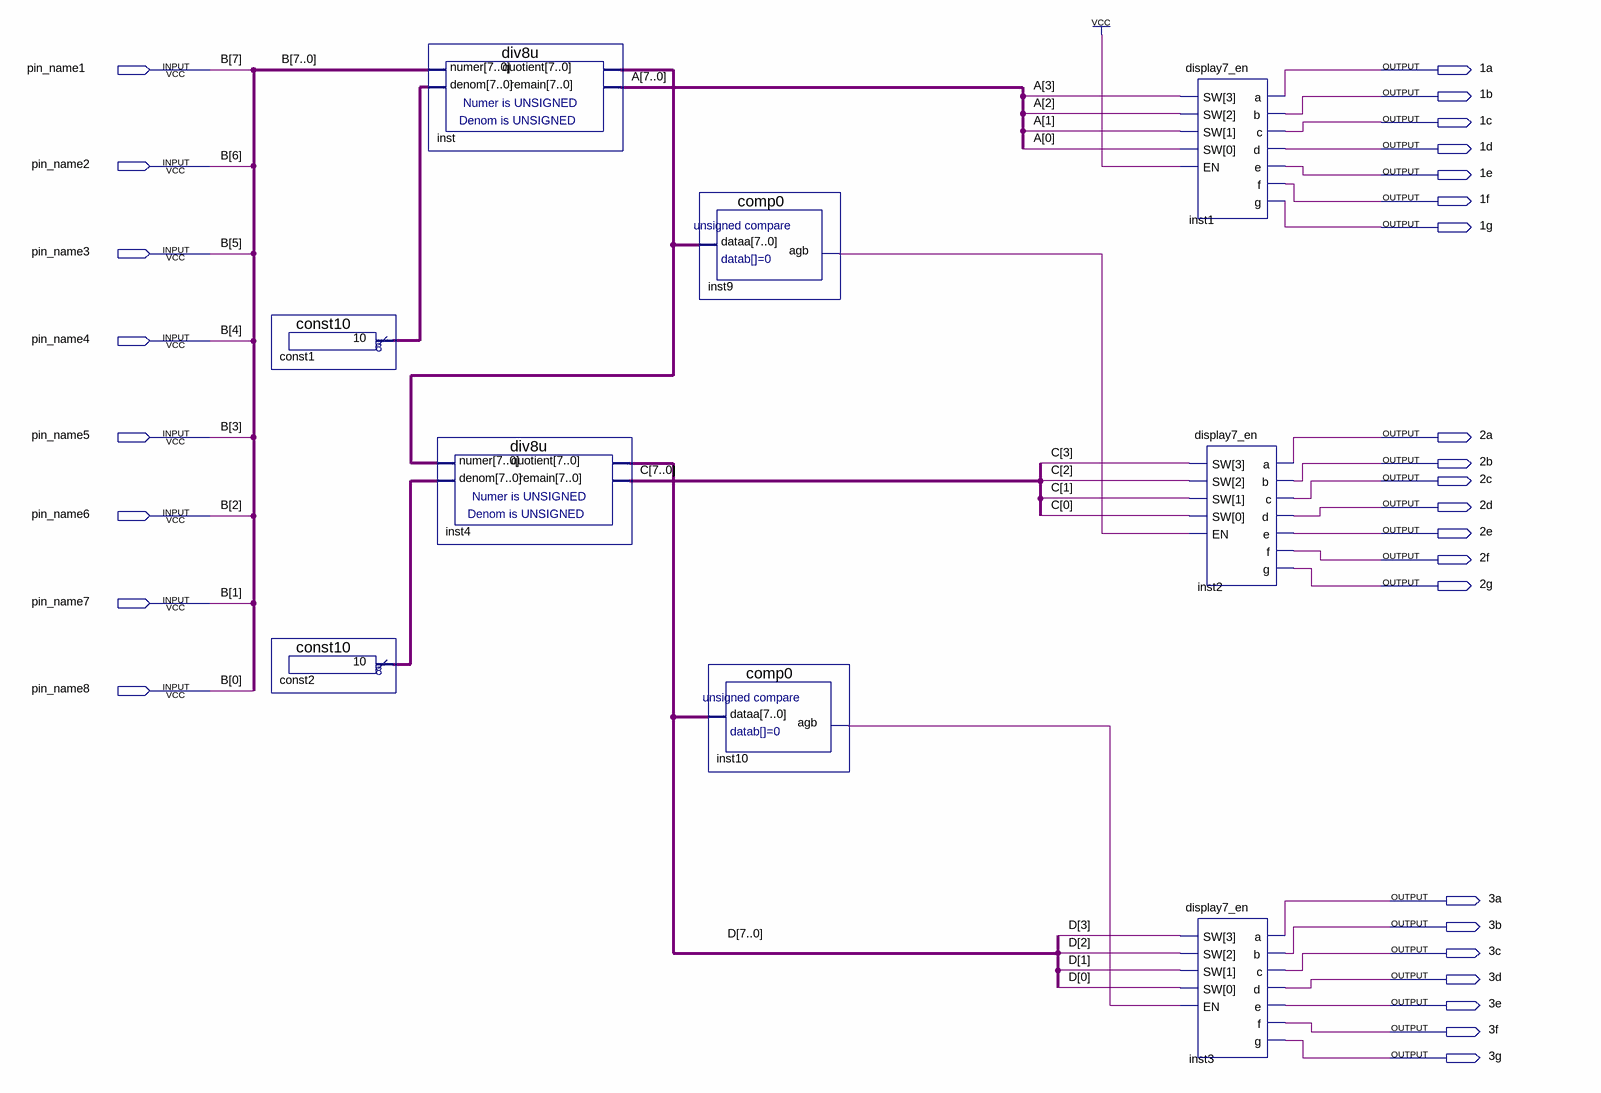
[diagram p0: schematic sheet]
// Quartus schematic display_8bits.bdf as structural Verilog: 9 symbols, 29 pins
module display_8bits (
  input  pin_name1,
  input  pin_name2,
  input  pin_name3,
  input  pin_name4,
  input  pin_name5,
  input  pin_name6,
  input  pin_name7,
  input  pin_name8,
  output \1a ,
  output \1b ,
  output \1c ,
  output \1d ,
  output \1e ,
  output \1f ,
  output \1g ,
  output \2a ,
  output \2b ,
  output \2c ,
  output \2d ,
  output \2e ,
  output \2f ,
  output \2g ,
  output \3a ,
  output \3b ,
  output \3c ,
  output \3d ,
  output \3e ,
  output \3f ,
  output \3g 
);

  wire inst9_agb, inst10_agb;
  wire [7:0] A, C, const1_result, const2_result, D, inst_quotient;

  const10 const1 (.result(const1_result));
  const10 const2 (.result(const2_result));
  div8u inst (
    .numer({pin_name1, pin_name2, pin_name3, pin_name4, pin_name5, pin_name6, pin_name7, pin_name8}),
    .denom(const1_result), .quotient(inst_quotient), .remain(A));
  div8u inst4 (.numer(inst_quotient), .denom(const2_result), .quotient(D), .remain(C));
  comp0 inst9 (.dataa(inst_quotient), .agb(inst9_agb));
  comp0 inst10 (.dataa(D), .agb(inst10_agb));
  display7_en inst1 (.SW(A[3:0]), .EN(1'b1), .a(\1a ), .b(\1b ), .c(\1c ), .d(\1d ), .e(\1e ), .f(\1f ), .g(\1g ));
  display7_en inst3 (
    .SW(D[3:0]), .EN(inst10_agb), .a(\3a ), .b(\3b ), .c(\3c ), .d(\3d ), .e(\3e ), .f(\3f ), .g(\3g ));
  display7_en inst2 (.SW(C[3:0]), .EN(inst9_agb), .a(\2a ), .b(\2b ), .c(\2c ), .d(\2d ), .e(\2e ), .f(\2f ), .g(\2g ));

  // Other names for the same wires on the sheet: B[7:0] = {pin_name1, pin_name2, pin_name3, pin_name4, pin_name5, pin_name6, pin_name7, pin_name8}
endmodule
